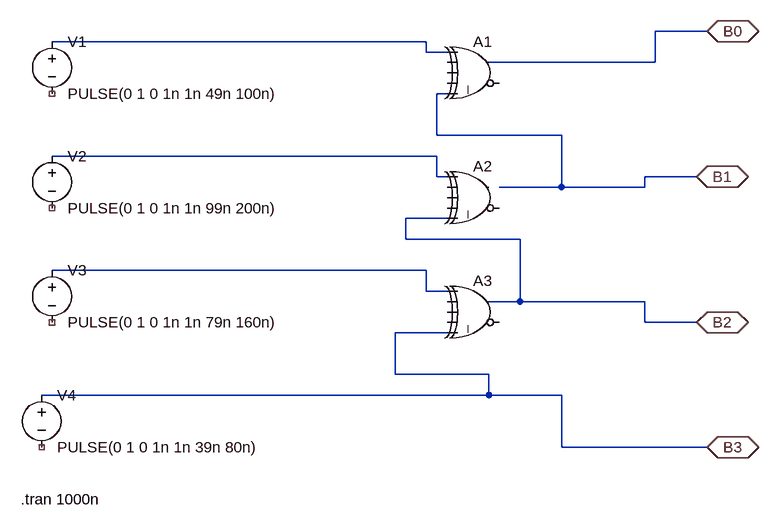
[diagram p0: schematic g2b.asc]
g2b.asc, the LTspice schematic file:
Version 4
SHEET 1 1132 752
WIRE 1040 16 960 16
WIRE 608 32 32 32
WIRE 608 48 608 32
WIRE 640 48 608 48
WIRE 960 64 960 16
WIRE 960 64 704 64
WIRE 640 112 624 112
WIRE 624 176 624 112
WIRE 816 176 624 176
WIRE 624 208 32 208
WIRE 624 240 624 208
WIRE 640 240 624 240
WIRE 1024 240 944 240
WIRE 816 256 816 176
WIRE 816 256 720 256
WIRE 944 256 944 240
WIRE 944 256 816 256
WIRE 640 304 576 304
WIRE 576 336 576 304
WIRE 752 336 576 336
WIRE 608 384 32 384
WIRE 608 416 608 384
WIRE 640 416 608 416
WIRE 752 432 752 336
WIRE 752 432 704 432
WIRE 944 432 752 432
WIRE 944 464 944 432
WIRE 1024 464 944 464
WIRE 640 480 560 480
WIRE 560 544 560 480
WIRE 704 544 560 544
WIRE 704 576 704 544
WIRE 704 576 16 576
WIRE 816 576 704 576
WIRE 816 656 816 576
WIRE 1040 656 816 656
FLAG 1040 16 B0
IOPIN 1040 16 BiDir
FLAG 1024 240 B1
IOPIN 1024 240 BiDir
FLAG 1024 464 B2
IOPIN 1024 464 BiDir
FLAG 1040 656 B3
IOPIN 1040 656 BiDir
SYMBOL voltage 32 16 R0
WINDOW 123 0 0 Left 0
WINDOW 39 0 0 Left 0
SYMATTR InstName V1
SYMATTR Value PULSE(0 1 0 1n 1n 49n 100n)
SYMBOL voltage 32 192 R0
WINDOW 123 0 0 Left 0
WINDOW 39 0 0 Left 0
SYMATTR InstName V2
SYMATTR Value PULSE(0 1 0 1n 1n 99n 200n)
SYMBOL voltage 32 368 R0
WINDOW 123 0 0 Left 0
WINDOW 39 0 0 Left 0
SYMATTR InstName V3
SYMATTR Value PULSE(0 1 0 1n 1n 79n 160n)
SYMBOL voltage 16 560 R0
WINDOW 123 0 0 Left 0
WINDOW 39 0 0 Left 0
SYMATTR InstName V4
SYMATTR Value PULSE(0 1 0 1n 1n 39n 80n)
SYMBOL Digital\\xor 688 16 R0
SYMATTR InstName A1
SYMBOL Digital\\xor 688 208 R0
SYMATTR InstName A2
SYMBOL Digital\\xor 688 384 R0
SYMATTR InstName A3
TEXT -16 736 Left 2 !.tran 1000n

The netlist it stands for:
* g2b.asc
V1 N001 NC_01 PULSE(0 1 0 1n 1n 49n 100n)
V2 N002 NC_02 PULSE(0 1 0 1n 1n 99n 200n)
V3 N003 NC_03 PULSE(0 1 0 1n 1n 79n 160n)
V4 B3 NC_04 PULSE(0 1 0 1n 1n 39n 80n)
A1 N001 0 0 0 B1 0 B0 0 XOR
A2 N002 0 0 0 B2 0 0 0 XOR
A3 N003 0 0 0 B3 0 B2 0 XOR
.tran 1000n
.backanno
.end